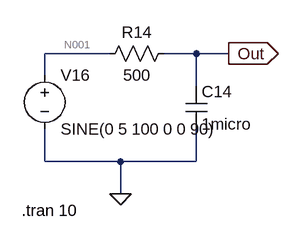
[diagram p0: schematic Draft2.asc]
Draft2.asc, the LTspice schematic file:
Version 4
SHEET 1 1868 2100
WIRE -832 224 -928 224
WIRE -704 224 -752 224
WIRE -656 224 -704 224
WIRE -928 256 -928 224
WIRE -704 272 -704 224
WIRE -928 384 -928 336
WIRE -816 384 -928 384
WIRE -704 384 -704 336
WIRE -704 384 -816 384
WIRE -816 432 -816 384
FLAG -816 432 0
FLAG -656 224 Out
IOPIN -656 224 Out
SYMBOL res -736 208 R90
WINDOW 0 0 56 VBottom 2
WINDOW 3 32 56 VTop 2
SYMATTR InstName R14
SYMATTR Value 500
SYMBOL cap -720 272 R0
SYMATTR InstName C14
SYMATTR Value 1micro
SYMBOL voltage -928 240 R0
WINDOW 123 0 0 Left 0
WINDOW 39 0 0 Left 0
SYMATTR InstName V16
SYMATTR Value SINE(0 5 100 0 0 90)
TEXT -962 456 Left 2 !.tran 10

The netlist it stands for:
* Draft2.asc
R14 Out N001 500
C14 Out 0 1micro
V16 N001 0 SINE(0 5 100 0 0 90)
.tran 10
.backanno
.end

* Results of the author's LTspice run, read from the files saved beside the schematic
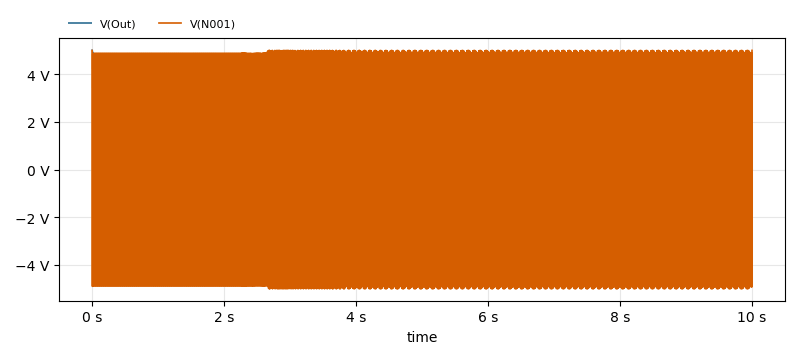
[diagram p1: Transient Analysis of Draft2.asc, plotted from the saved traces]
* Transient Analysis, 1 run:
*   V(Out): min -14.89 mV, max 5 V, average 249.7 mV, rms 790.6 mV, last 69.1 µV
*   V(N001): min -5 V, max 5 V, average -297.1 µV, rms 3.579 V, last 5 V